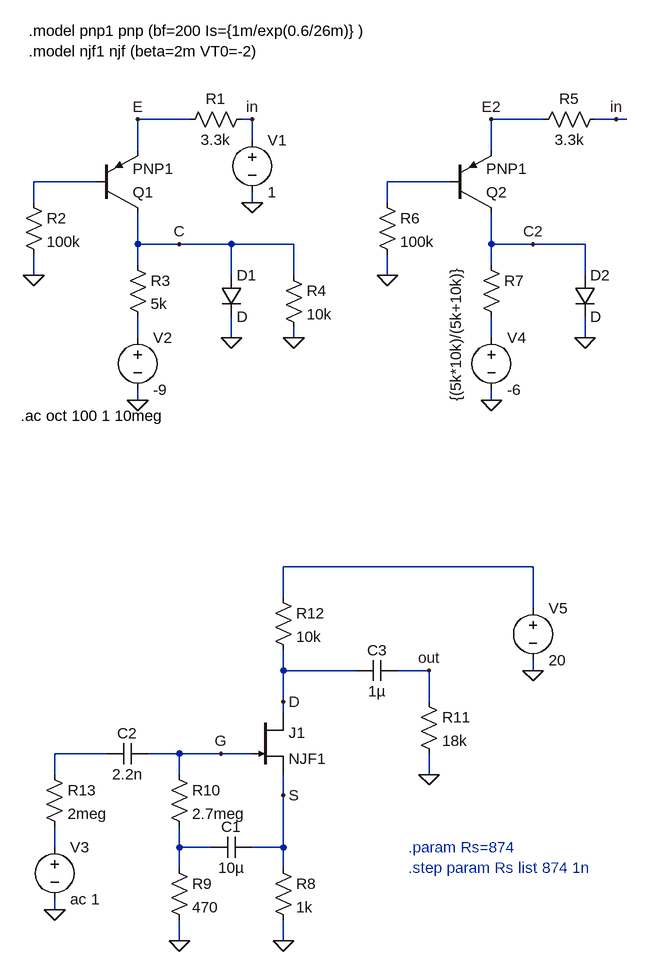
[diagram p0: schematic ws11_12.asc]
ws11_12.asc, the LTspice schematic file:
Version 4
SHEET 1 1028 1444
WIRE 256 160 176 160
WIRE 352 160 336 160
WIRE 800 160 720 160
WIRE 912 160 880 160
WIRE 928 160 912 160
WIRE 352 192 352 160
WIRE 176 208 176 160
WIRE 720 208 720 160
WIRE 112 256 16 256
WIRE 656 256 560 256
WIRE 16 288 16 256
WIRE 352 288 352 272
WIRE 560 288 560 256
WIRE 176 352 176 304
WIRE 240 352 176 352
WIRE 320 352 240 352
WIRE 416 352 320 352
WIRE 720 352 720 304
WIRE 784 352 720 352
WIRE 864 352 784 352
WIRE 176 384 176 352
WIRE 720 384 720 352
WIRE 16 400 16 368
WIRE 320 400 320 352
WIRE 416 400 416 352
WIRE 560 400 560 368
WIRE 864 400 864 352
WIRE 176 496 176 464
WIRE 320 496 320 464
WIRE 416 496 416 480
WIRE 720 496 720 464
WIRE 864 496 864 464
WIRE 176 592 176 576
WIRE 720 592 720 576
WIRE 784 848 400 848
WIRE 400 896 400 848
WIRE 784 912 784 848
WIRE 400 1008 400 976
WIRE 512 1008 400 1008
WIRE 624 1008 576 1008
WIRE 784 1008 784 992
WIRE 400 1056 400 1008
WIRE 624 1056 624 1008
WIRE 400 1072 400 1056
WIRE 128 1136 48 1136
WIRE 240 1136 192 1136
WIRE 304 1136 240 1136
WIRE 352 1136 304 1136
WIRE 48 1168 48 1136
WIRE 240 1168 240 1136
WIRE 624 1168 624 1136
WIRE 400 1200 400 1168
WIRE 48 1280 48 1248
WIRE 240 1280 240 1248
WIRE 288 1280 240 1280
WIRE 400 1280 400 1200
WIRE 400 1280 352 1280
WIRE 240 1312 240 1280
WIRE 400 1312 400 1280
WIRE 48 1376 48 1360
WIRE 240 1424 240 1392
WIRE 400 1424 400 1392
FLAG 176 592 0
FLAG 320 496 0
FLAG 416 496 0
FLAG 16 400 0
FLAG 352 288 0
FLAG 176 160 E
FLAG 240 352 C
FLAG 720 592 0
FLAG 864 496 0
FLAG 560 400 0
FLAG 720 160 E2
FLAG 784 352 C2
FLAG 912 160 in
FLAG 352 160 in
FLAG 48 1376 0
FLAG 784 1008 0
FLAG 240 1424 0
FLAG 400 1424 0
FLAG 624 1168 0
FLAG 400 1056 D
FLAG 400 1200 S
FLAG 304 1136 G
FLAG 624 1008 out
SYMBOL voltage 352 176 R0
SYMATTR InstName V1
SYMATTR Value 1
SYMBOL res 240 176 R270
WINDOW 0 32 56 VTop 2
WINDOW 3 0 56 VBottom 2
SYMATTR InstName R1
SYMATTR Value 3.3k
SYMBOL pnp 112 304 M180
SYMATTR InstName Q1
SYMATTR Value PNP1
SYMBOL res 0 272 R0
SYMATTR InstName R2
SYMATTR Value 100k
SYMBOL res 160 368 R0
SYMATTR InstName R3
SYMATTR Value 5k
SYMBOL voltage 176 480 R0
WINDOW 123 0 0 Left 2
WINDOW 39 0 0 Left 2
SYMATTR InstName V2
SYMATTR Value -9
SYMBOL diode 304 400 R0
SYMATTR InstName D1
SYMBOL res 400 384 R0
SYMATTR InstName R4
SYMATTR Value 10k
SYMBOL res 784 176 R270
WINDOW 0 32 56 VTop 2
WINDOW 3 0 56 VBottom 2
SYMATTR InstName R5
SYMATTR Value 3.3k
SYMBOL pnp 656 304 M180
SYMATTR InstName Q2
SYMATTR Value PNP1
SYMBOL res 544 272 R0
SYMATTR InstName R6
SYMATTR Value 100k
SYMBOL res 704 368 R0
WINDOW 3 -39 17 VRight 2
SYMATTR InstName R7
SYMATTR Value {(5k*10k)/(5k+10k)}
SYMBOL voltage 720 480 R0
WINDOW 123 0 0 Left 2
WINDOW 39 0 0 Left 2
SYMATTR InstName V4
SYMATTR Value -6
SYMBOL diode 848 400 R0
SYMATTR InstName D2
SYMBOL njf 352 1072 R0
SYMATTR InstName J1
SYMATTR Value NJF1
SYMBOL res 384 1296 R0
SYMATTR InstName R8
SYMATTR Value 1k
SYMBOL res 224 1296 R0
SYMATTR InstName R9
SYMATTR Value 470
SYMBOL res 224 1152 R0
SYMATTR InstName R10
SYMATTR Value 2.7meg
SYMBOL cap 352 1264 R90
WINDOW 0 0 32 VBottom 2
WINDOW 3 32 32 VTop 2
SYMATTR InstName C1
SYMATTR Value 10µ
SYMBOL cap 192 1120 R90
WINDOW 0 0 32 VBottom 2
WINDOW 3 32 32 VTop 2
SYMATTR InstName C2
SYMATTR Value 2.2n
SYMBOL cap 576 992 R90
WINDOW 0 0 32 VBottom 2
WINDOW 3 32 32 VTop 2
SYMATTR InstName C3
SYMATTR Value 1µ
SYMBOL res 608 1040 R0
SYMATTR InstName R11
SYMATTR Value 18k
SYMBOL res 384 880 R0
SYMATTR InstName R12
SYMATTR Value 10k
SYMBOL res 32 1152 R0
SYMATTR InstName R13
SYMATTR Value 2meg
SYMBOL voltage 48 1264 R0
WINDOW 123 0 0 Left 2
WINDOW 39 0 0 Left 2
SYMATTR InstName V3
SYMATTR Value ac 1
SYMBOL voltage 784 896 R0
WINDOW 123 0 0 Left 2
WINDOW 39 0 0 Left 2
SYMATTR InstName V5
SYMATTR Value 20
TEXT 8 24 Left 2 !.model pnp1 pnp (bf=200 Is={1m/exp(0.6/26m)} )\n.model njf1 njf (beta=2m VT0=-2)
TEXT -4 616 Left 2 !.ac oct 100 1 10meg
TEXT 592 1280 Left 2 ;.param Rs=874\n.step param Rs list 874 1n

The netlist it stands for:
* ws11_12.asc
V1 in 0 1
R1 E in 3.3k
Q1 C N001 E 0 PNP1
R2 N001 0 100k
R3 C N003 5k
V2 N003 0 -9
D1 C 0 D
R4 C 0 10k
R5 E2 in 3.3k
Q2 C2 N002 E2 0 PNP1
R6 N002 0 100k
R7 C2 N004 {(5k*10k)/(5k+10k)}
V4 N004 0 -6
D2 C2 0 D
J1 D G S NJF1
R8 S 0 1k
R9 N008 0 470
R10 G N008 2.7meg
C1 S N008 10µ
C2 G N006 2.2n
C3 out D 1µ
R11 out 0 18k
R12 N005 D 10k
R13 N006 N007 2meg
V3 N007 0 ac 1
V5 N005 0 20
.model D D
.lib standard.dio
.model NPN NPN
.model PNP PNP
.lib standard.bjt
.model NJF NJF
.model PJF PJF
.lib standard.jft
.model pnp1 pnp (bf=200 Is={1m/exp(0.6/26m)} )
.model njf1 njf (beta=2m VT0=-2)
.ac oct 100 1 10meg
* .param Rs=874
* .step param Rs list 874 1n
.backanno
.end